# EasyEDA Pro project ProProject_FOC_Driver V2.0_2024-05-31.epro, board PCB1
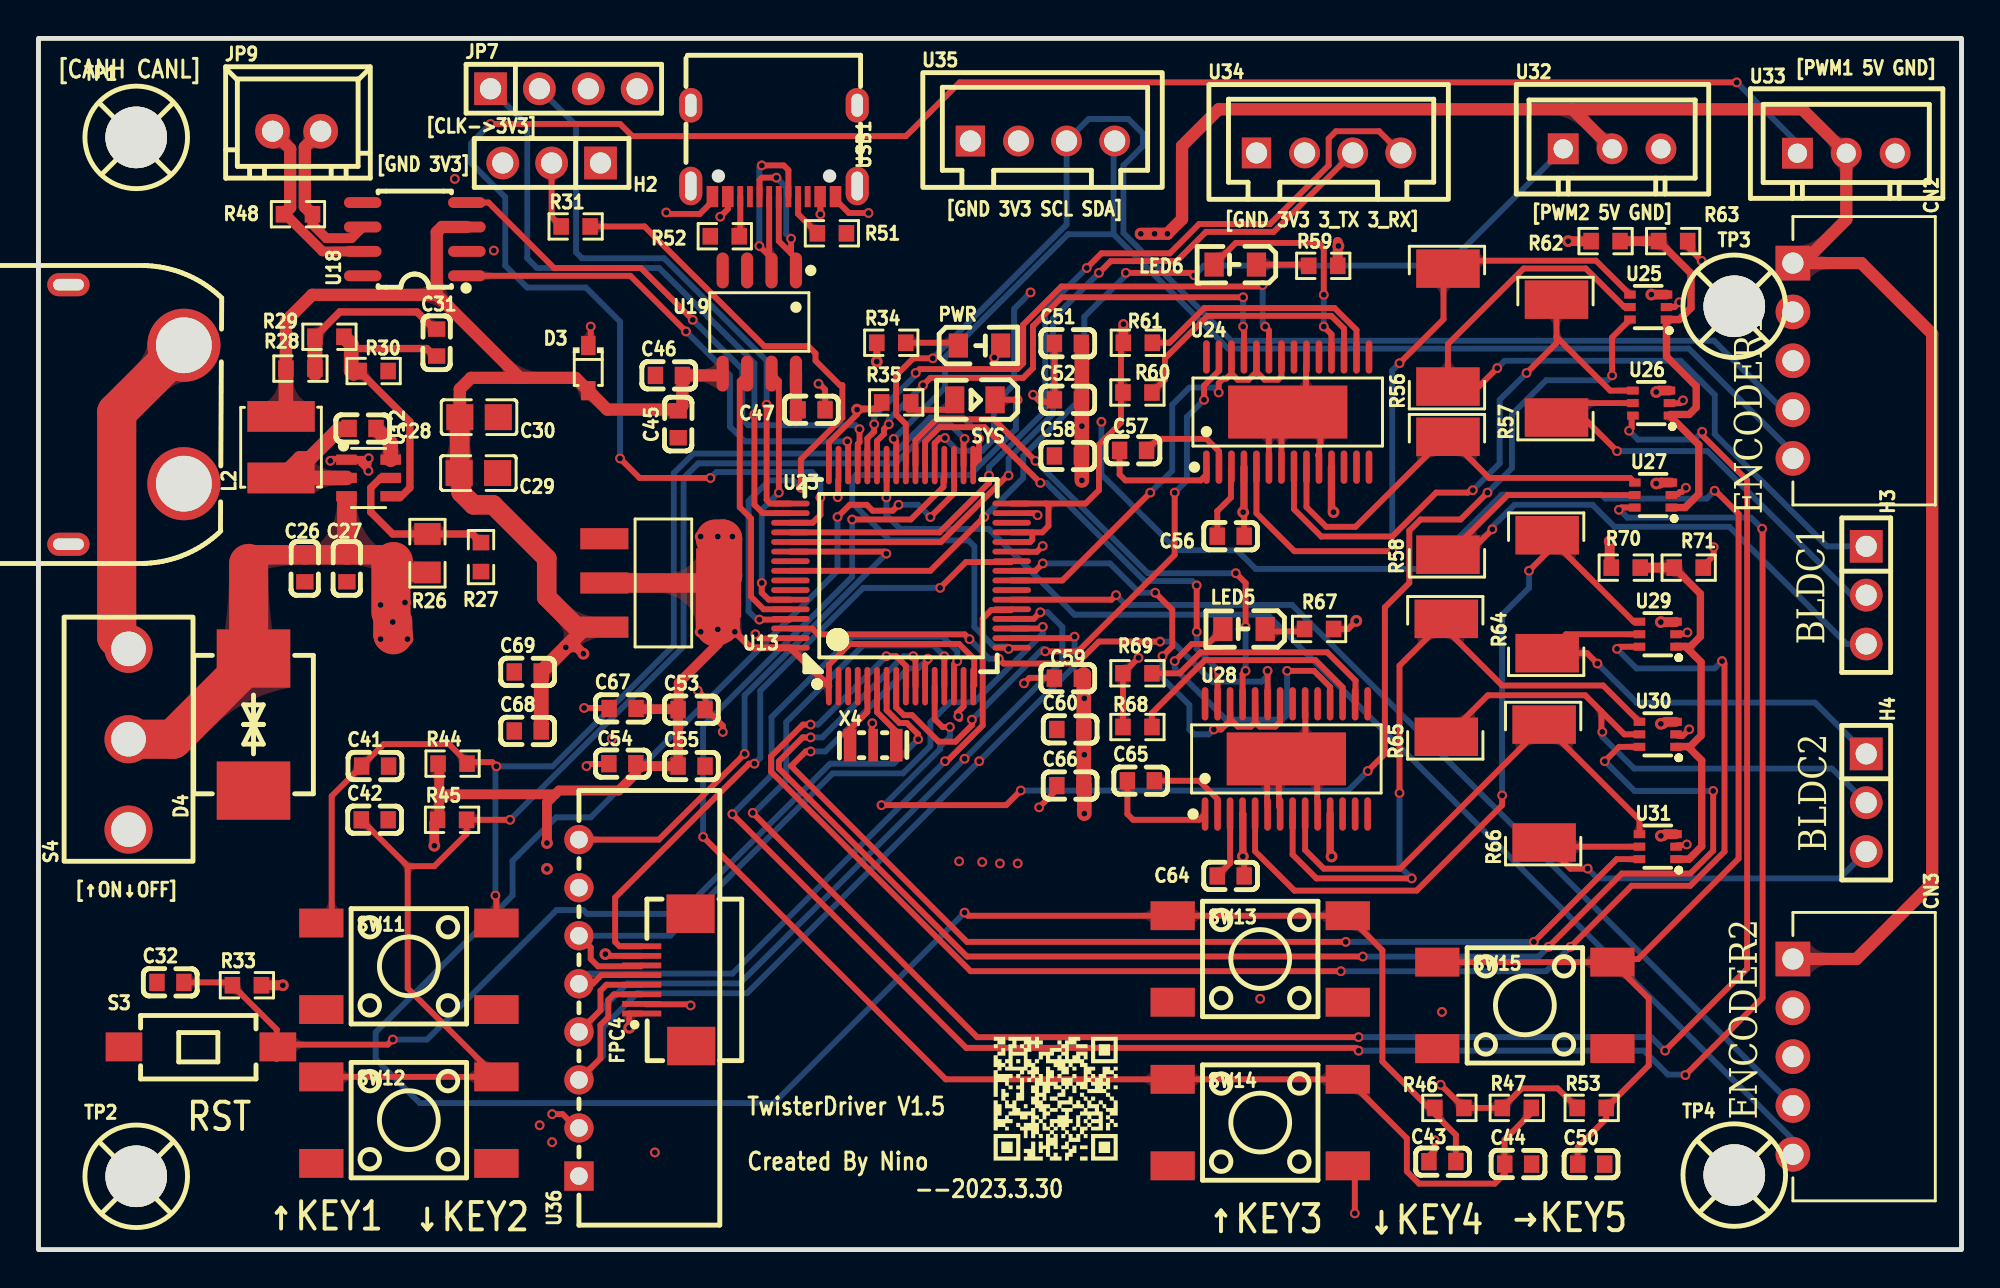
[diagram p2: board, top side]
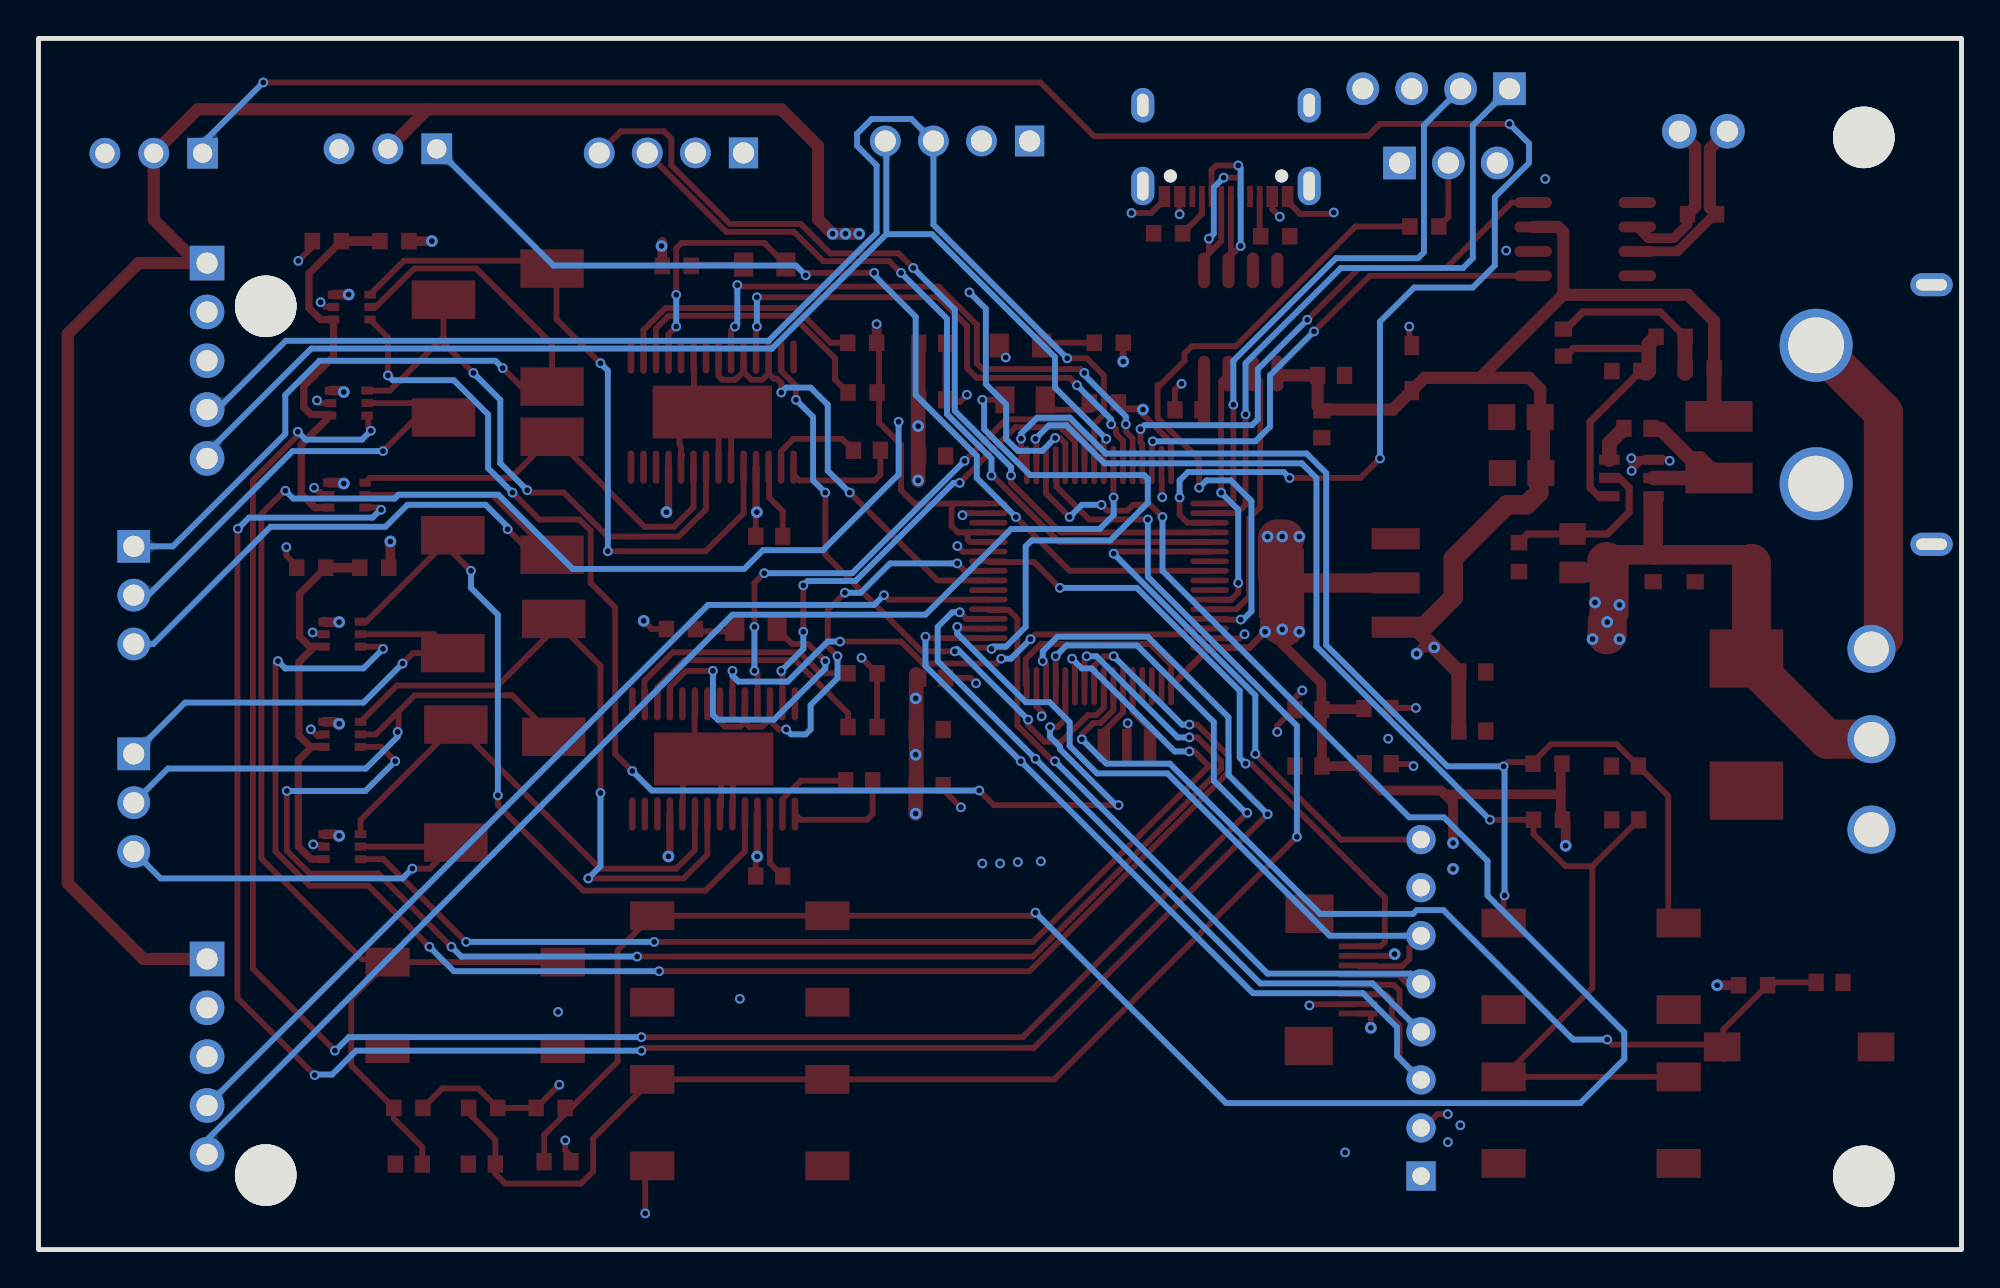
[diagram p3: board, bottom side, seen from below]

Outline 99.95 x 62.99 mm; copper layers: Top Layer, Inner1, Inner2, Bottom Layer. Coordinates in mm from the lower left corner of the outline.
Outline path: rectangle 0,62.99 99.95,0
Stack: Top Layer 0.035mm 外层铜厚1oz / Dielectric1 0.2104mm 7628 RC49% 8.6mil / Inner1 0.0152mm 内层铜厚 / Dielectric2 1.065mm 1.1mm H/HOZ 含铜 / Inner2 0.0152mm 内层铜厚 / Dielectric3 0.2104mm 7628 RC49% 8.6mil / Bottom Layer 0.035mm 外层铜厚1oz

## Design rules (mm)
template: JLCPCB Capability(Two Layers Board)
spacing copperThickness1oz (default): track to track 0.102, other pairs 0.152 to 0.3
spacing copperThickness2oz: track to track 0.203, other pairs 0.152 to 0.3
track width copperThickness1oz (default): min 0.127, default 0.254, max 2.54
track width copperThickness2oz: min 0.203, default 0.254, max 2.54
differential pair differentialPair (default): width min 0.127, default 0.254, max 2.54; gap min 0.152, default 0.152
via viaSize (default): diameter min 0.5, default 0.61, max 10; hole min 0.3, default 0.305, max 6.3

## Placement (name value [footprint] x y rotation side)
C26  100nF  [C0603]  13.84 35.43 90 top
C27  100nF  [C0603]  16.03 35.43 90 top
C28  100nF  [C0603]  16.84 42.71 180 top
C29  22uF  [C0805]  22.86 40.39 180 top
C30  22uF  [C0805]  22.9 43.3 180 top
C31  75pF  [C0603]  20.7 47.17 90 top
C32  100nF  [C0603]  6.86 13.9 0 top
C41  100nF  [C0603]  17.5 25.15 0 top
C42  100nF  [C0603]  17.48 22.35 0 top
C43  100nF  [C0603]  72.97 4.57 180 top
C44  100nF  [C0603]  76.91 4.45 0 top
C45  100nF  [C0603]  33.25 42.93 270 top
C46  100nF  [C0603]  32.77 45.47 0 top
C47  100nF  [C0603]  40.18 43.68 0 top
C50  100nF  [C0603]  80.7 4.44 0 top
C51  100nF  [C0603]  53.5 47.14 0 top
C52  100nF  [C0603]  53.5 44.2 0 top
C53  100nF  [C0603]  33.94 28.08 0 top
C54  100nF  [C0603]  30.34 25.27 180 top
C55  100nF  [C0603]  33.94 25.15 0 top
C56  100nF  [C0603]  61.97 37.1 0 top
C57  10nF  [C0603]  56.89 41.57 0 top
C58  100nF  [C0603]  53.5 41.28 0 top
C59  100nF  [C0603]  53.5 29.72 0 top
C60  100nF  [C0603]  53.63 27.05 0 top
C64  100nF  [C0603]  61.97 19.43 0 top
C65  10nF  [C0603]  57.29 24.38 0 top
C66  100nF  [C0603]  53.63 24.13 0 top
C67  100nF  [C0603]  30.36 28.14 0 top
C68  100nF  [C0603]  25.43 26.97 0 top
C69  10uF  [C0603]  25.43 30.04 0 top
CN1  XT60PW-M  [CONN-TH_XT60PW-M]  4.56 43.43 0 top
CN2  XH-5AW  [CONN-TH_5P-P2.54_XH-5AW_C2908614]  91.19 46.23 270 top
CN3  XH-5AW  [CONN-TH_5P-P2.54_XH-5AW_C2908614]  91.19 10.03 270 top
D3  B5819WS  [SOD-323_L1.8-W1.3-LS2.5-RD]  28.57 45.85 270 top
D4  SMDJ24CA  [SMC_L6.9-W5.9-LS7.9-BI]  11.18 27.31 90 top
FPC4  FPC-05F-8PH20  [fpc-smd_8p-p0.50_fpc-05f-8ph20]  32.64 14.03 90 top
H2  PZ254V-11-03P  [HDR-TH_3P-P2.54-V-M]  26.67 56.52 180 top
H3  PZ254V-11-03P  [HDR-TH_3P-P2.54-V-M]  95 34.04 270 top
H4  PZ254V-11-03P  [HDR-TH_3P-P2.54-V-M]  95 23.24 270 top
JP7  PZ254V-11-04P  [HDR-TH_4P-P2.54-V-M]  27.31 60.38 0 top
JP9  XH-2A  [CONN-TH_2P-P2.50_HCTL_XH-2A-X]  13.42 58.17 0 top
L2  15uH  [IND-SMD_L4.0-W4.0]  12.61 41.73 90 top
LED5  XL-2012SURC  [LED0805-RD_RED]  62.66 32.28 180 top
LED6  XL-2012SURC  [LED0805-RD_RED]  62.2 51.23 180 top
PWR  XL-2012SURC  [LED0805-RD_RED]  48.91 47.02 0 top
R26  511kΩ  [R0805]  20.22 36.22 270 top
R27  105kΩ  [R0603]  23 36.02 90 top
R28  49.9Ω  [R0603]  13.61 45.82 180 top
R29  100kΩ  [R0603]  15.12 47.48 180 top
R30  13.3kΩ  [R0603]  17.42 45.69 180 top
R31  10kΩ  [R0603]  27.92 53.21 0 top
R33  10kΩ  [R0603]  10.83 13.75 0 top
R34  1kΩ  [R0603]  44.32 47.17 0 top
R35  1kΩ  [R0603]  44.58 44.06 0 top
R44  10kΩ  [R0603]  21.52 25.27 0 top
R45  10kΩ  [R0603]  21.5 22.35 0 top
R46  10kΩ  [R0603]  73.33 7.37 180 top
R47  10kΩ  [R0603]  76.84 7.37 0 top
R48  120Ω  [R0603]  13.49 53.85 180 top
R51  5.1kΩ  [R0603]  41.24 52.86 0 top
R52  5.1kΩ  [R0603]  35.67 52.71 180 top
R53  10kΩ  [R0603]  80.73 7.37 0 top
R56  10mΩ  [RES-SMD_L6.4-W3.2-R2512]  73.26 47.95 90 top
R57  10mΩ  [RES-SMD_L6.4-W3.2-R2512]  78.9 46.34 90 top
R58  10mΩ  [RES-SMD_L6.4-W3.2-R2512]  73.26 39.21 90 top
R59  10kΩ  [R0603]  66.78 51.17 0 top
R60  10kΩ  [R0603]  57.12 44.58 180 top
R61  10kΩ  [R0603]  57.14 47.17 180 top
R62  10kΩ  [R0603]  81.45 52.45 180 top
R63  10kΩ  [R0603]  84.96 52.45 180 top
R64  10mΩ  [RES-SMD_L6.4-W3.2-R2512]  78.41 34.09 90 top
R65  10mΩ  [RES-SMD_L6.4-W3.2-R2512]  73.17 29.74 90 top
R66  10mΩ  [RES-SMD_L6.4-W3.2-R2512]  78.26 24.24 90 top
R67  10kΩ  [R0603]  66.56 32.28 0 top
R68  10kΩ  [R0603]  57.12 27.18 180 top
R69  10kΩ  [R0603]  57.12 29.97 180 top
R70  10kΩ  [R0603]  82.5 35.47 180 top
R71  10kΩ  [R0603]  85.77 35.47 180 top
S3  TS-1101-C-W  [SW-SMD_L6.0-W3.3-LS8.0]  8.44 10.54 0 top
S4  SS-12D10L5  [SW-TH_SS-12D10L5]  4.68 26.54 90 top
SW11  -  [SW-SMD_4P-L6.0-W6.0-P4.50-LS9.0-2]  19.25 14.73 0 top
SW12  -  [SW-SMD_4P-L6.0-W6.0-P4.50-LS9.0-2]  19.25 6.73 0 top
SW13  -  [SW-SMD_4P-L6.0-W6.0-P4.50-LS9.0-2]  63.5 15.11 0 top
SW14  -  [SW-SMD_4P-L6.0-W6.0-P4.50-LS9.0-2]  63.5 6.6 0 top
SW15  -  [SW-SMD_4P-L6.0-W6.0-P4.50-LS9.0-2]  77.25 12.7 0 top
SYS  NCD0805G1  [LED0805-R-RD]  48.67 44.2 180 top
TP1  -  [M3螺丝]  5.14 57.78 0 top
TP2  -  [M3螺丝]  5.14 3.75 0 top
TP3  -  [M3螺丝]  88.2 49 0 top
TP4  -  [M3螺丝]  88.2 3.81 0 top
U12  TPS54202DDCR  [SOT-23-6_L2.9-W1.6-P0.95-LS2.8-BL]  17.16 40.13 270 top
U13  LM1117S-3.3  [SOT-223-3_L6.5-W3.4-P2.30-LS7.0-BR]  32.38 34.67 180 top
U18  TJA1050T/CM,118  [SOIC-8_L5.0-W4.0-P1.27-LS6.0-BL]  19.56 52.55 90 top
U19  CH340N  [SOP-8_L4.9-W3.9-P1.27-LS6.0-BL]  37.47 48.24 180 top
U23  STM32G431RBT6  [LQFP-64_L10.0-W10.0-P0.50-LS12.0-BL]  44.83 35.05 0 top
U24  DRV8313PWPR  [HTSSOP-28_L9.8-W4.5-P0.65-LS6.6-BL-EP]  64.93 43.56 0 top
U25  INA199A1DCKR  [SC-70-6_L2.2-W1.3-P0.65-LS2.1-BR]  83.67 49.02 0 top
U26  INA199A1DCKR  [SC-70-6_L2.2-W1.3-P0.65-LS2.1-BR]  83.82 44.03 0 top
U27  INA199A1DCKR  [SC-70-6_L2.2-W1.3-P0.65-LS2.1-BR]  83.92 39.24 0 top
U28  DRV8313PWPR  [HTSSOP-28_L9.8-W4.5-P0.65-LS6.6-BL-EP]  64.86 25.52 0 top
U29  INA199A1DCKR  [SC-70-6_L2.2-W1.3-P0.65-LS2.1-BR]  84.16 32 0 top
U30  INA199A1DCKR  [SC-70-6_L2.2-W1.3-P0.65-LS2.1-BR]  84.16 26.8 0 top
U31  INA199A1DCKR  [SC-70-6_L2.2-W1.3-P0.65-LS2.1-BR]  84.16 20.96 0 top
U32  ZX-XH2.54-3PZZ  [CONN-TH_3P-P2.54_2501S-3P]  81.79 57.25 0 top
U33  ZX-XH2.54-3PZZ  [CONN-TH_3P-P2.54_2501S-3P]  93.96 57.02 0 top
U34  ZX-XH2.54-4PZZ  [CONN-TH_4P-P2.50_4PIN]  67.06 57.04 0 top
U35  ZX-XH2.54-4PZZ  [CONN-TH_4P-P2.50_4PIN]  52.19 57.66 0 top
U36  ZX-XH2.54-8PWZ  [CONN-TH_8P-P2.50_ZX-XH2.54-8PWZ]  28.09 12.57 90 top
USB1  TYPE-C 16PIN 2MD(073)  [USB-C-SMD_TYPE-C-6PIN-2MD-073]  38.23 57.14 180 top
X4  8MHz  [OSC-SMD_3P-L3.2-W1.3-P1.2-L]  43.38 26.23 0 top

## Footprints (pads in the part's own frame, mm; a bottom-side part is the same pattern mirrored in y, then rotated)
C0603
  rect 0.8x0.9 smd: 1(-0.7,0) 2(0.7,0)
C0805
  rect 1.41x1.35 smd: 1(-1,0) 2(1,0)
CONN-TH_2P-P2.50_HCTL_XH-2A-X
  round 1.8 hole 1.1: 1(-1.251,0) 2(1.251,0)
CONN-TH_3P-P2.54_2501S-3P
  rect 1.6x1.6 hole 1: 1(-2.54,0)
  round 1.6 hole 1: 2(0,0) 3(2.54,0)
CONN-TH_4P-P2.50_4PIN
  rect 1.524x1.6 hole 1.1: 1(-3.75,0)
  round 1.6 hole 1.1: 2(-1.25,0) 3(1.25,0) 4(3.75,0)
CONN-TH_5P-P2.54_XH-5AW_C2908614
  rect 1.8x1.8 hole 1.1: 1(-5.08,0)
  round 1.8 hole 1.1: 2(-2.54,0) 3(0,0) 4(2.54,0) 5(5.08,0)
CONN-TH_8P-P2.50_ZX-XH2.54-8PWZ
  rect 1.524x1.524 hole 0.914: 1(-8.75,0)
  round 1.524 hole 0.914: 2(-6.25,0) 3(-3.75,0) 4(-1.25,0) 5(1.25,0) 6(3.75,0) 7(6.25,0) 8(8.75,0)
CONN-TH_XT60PW-M
  round 3.8 hole 2.9: 1(3,-3.6) 2(3,3.6)
  oval 2.2x1.2 hole 1.6x0.6: 3(-3,6.75) 4(-3,-6.75)
fpc-smd_8p-p0.50_fpc-05f-8ph20
  rect 0.3x2.032 smd: 1(-1.75,1.288) 2(-1.25,1.288) 3(-0.75,1.288) 4(-0.25,1.288) 5(0.25,1.288) 6(0.75,1.288) 7(1.25,1.288) 8(1.75,1.288)
  rect 2x2.5 smd: 9(3.44,-1.252) 10(-3.44,-1.288)
HDR-TH_3P-P2.54-V-M
  rect 1.7x1.7 hole 1.1: 1(-2.54,0)
  round 1.7 hole 1.1: 2(0,0) 3(2.54,0)
HDR-TH_4P-P2.54-V-M
  rect 1.7x1.7 hole 1.1: 1(-3.81,0)
  round 1.7 hole 1.1: 2(-1.27,0) 3(1.27,0) 4(3.81,0)
HTSSOP-28_L9.8-W4.5-P0.65-LS6.6-BL-EP
  oval 0.343x1.732 smd: 1(-4.225,-2.866) 2(-3.575,-2.866) 3(-2.925,-2.866) 4(-2.275,-2.866) 5(-1.625,-2.866) 6(-0.975,-2.866) 7(-0.325,-2.866) 8(0.325,-2.866) 9(0.975,-2.866) 10(1.625,-2.866) 11(2.275,-2.866) 12(2.925,-2.866) 13(3.575,-2.866) 14(4.225,-2.866) 15(4.225,2.866) 16(3.575,2.866) 17(2.925,2.866) 18(2.275,2.866) 19(1.625,2.866) 20(0.975,2.866) 21(0.325,2.866) 22(-0.325,2.866) 23(-0.975,2.866) 24(-1.625,2.866) 25(-2.275,2.866) 26(-2.925,2.866) 27(-3.575,2.866) 28(-4.225,2.866)
  rect 6.2x2.75 smd: 29(0,0)
IND-SMD_L4.0-W4.0
  rect 1.6x3.5 smd: 1(-1.6,0) 2(1.6,0)
LED0805-R-RD
  rect 1x1.399 smd: 1(1.05,0) 2(-1.05,0)
LED0805-RD_RED
  rect 1x1.25 smd: 1(-1.1,0) 2(1.1,0)
LQFP-64_L10.0-W10.0-P0.50-LS12.0-BL
  oval 0.3x2 smd: 1(-3.75,-5.75) 2(-3.25,-5.75) 3(-2.75,-5.75) 4(-2.25,-5.75) 5(-1.75,-5.75) 6(-1.25,-5.75) 7(-0.75,-5.75) 8(-0.25,-5.75) 9(0.25,-5.75) 10(0.75,-5.75) 11(1.25,-5.75) 12(1.75,-5.75) 13(2.25,-5.75) 14(2.75,-5.75) 15(3.25,-5.75) 16(3.75,-5.75) 33(3.75,5.75) 34(3.25,5.75) 35(2.75,5.75) 36(2.25,5.75) 37(1.75,5.75) 38(1.25,5.75) 39(0.75,5.75) 40(0.25,5.75) 41(-0.25,5.75) 42(-0.75,5.75) 43(-1.25,5.75) 44(-1.75,5.75) 45(-2.25,5.75) 46(-2.75,5.75) 47(-3.25,5.75) 48(-3.75,5.75)
  oval 2x0.3 smd: 17(5.75,-3.75) 18(5.75,-3.25) 19(5.75,-2.75) 20(5.75,-2.25) 21(5.75,-1.75) 22(5.75,-1.25) 23(5.75,-0.75) 24(5.75,-0.25) 25(5.75,0.25) 26(5.75,0.75) 27(5.75,1.25) 28(5.75,1.75) 29(5.75,2.25) 30(5.75,2.75) 31(5.75,3.25) 32(5.75,3.75) 49(-5.75,3.75) 50(-5.75,3.25) 51(-5.75,2.75) 52(-5.75,2.25) 53(-5.75,1.75) 54(-5.75,1.25) 55(-5.75,0.75) 56(-5.75,0.25) 57(-5.75,-0.25) 58(-5.75,-0.75) 59(-5.75,-1.25) 60(-5.75,-1.75) 61(-5.75,-2.25) 62(-5.75,-2.75) 63(-5.75,-3.25) 64(-5.75,-3.75)
M3螺丝
  round 3.2 hole 3.2: 1(-0.064,0.064)
OSC-SMD_3P-L3.2-W1.3-P1.2-L
  rect 0.65x1.7 smd: 1(-1.2,0) 3(1.2,0)
  rect 0.5x1.7 smd: 2(0,0)
R0603
  rect 0.806x0.864 smd: 1(-0.753,0) 2(0.753,0)
R0805
  rect 1.133x1.377 smd: 1(-1,0) 2(1,0)
RES-SMD_L6.4-W3.2-R2512
  rect 2x3.3 smd: 1(-3.067,0) 2(3.067,0)
SC-70-6_L2.2-W1.3-P0.65-LS2.1-BR
  rect 0.6x0.42 smd: 1(0.95,-0.65) 2(0.95,0) 3(0.95,0.65) 4(-0.95,0.65) 5(-0.95,0) 6(-0.95,-0.65)
SMC_L6.9-W5.9-LS7.9-BI
  rect 3.03x3.82 smd: 1(-3.435,0) 2(3.435,0)
SOD-323_L1.8-W1.3-LS2.5-RD
  rect 1x0.75 smd: 1(-1.173,0) 2(1.173,0)
SOIC-8_L5.0-W4.0-P1.27-LS6.0-BL
  oval 0.569x1.95 smd: 1(-1.905,-2.705) 2(-0.635,-2.705) 3(0.635,-2.705) 4(1.905,-2.705) 5(1.905,2.705) 6(0.635,2.705) 7(-0.635,2.705) 8(-1.905,2.705)
SOP-8_L4.9-W3.9-P1.27-LS6.0-BL
  oval 0.63x1.865 smd: 1(-1.905,-2.683) 2(-0.635,-2.683) 3(0.635,-2.683) 4(1.905,-2.683) 5(1.905,2.683) 6(0.635,2.683) 7(-0.635,2.683) 8(-1.905,2.683)
SOT-23-6_L2.9-W1.6-P0.95-LS2.8-BL
  rect 0.532x1.072 smd: 1(-0.95,-1.149) 2(0,-1.149) 3(0.95,-1.149) 4(0.95,1.149) 5(0,1.149) 6(-0.95,1.149)
SOT-223-3_L6.5-W3.4-P2.30-LS7.0-BR
  rect 2.5x1.1 smd: 1(2.97,-2.3) 2(2.97,0) 3(2.97,2.3)
  rect 2.34x3.6 smd: 4(-2.97,0)
SW-SMD_4P-L6.0-W6.0-P4.50-LS9.0-2
  rect 2.3x1.5 smd: 1(-4.55,2.25) 2(4.55,2.25) 3(-4.55,-2.25) 4(4.55,-2.25)
SW-SMD_L6.0-W3.3-LS8.0
  rect 1.9x1.5 smd: 1(-4,0) 2(4,0)
SW-TH_SS-12D10L5
  round 2.5 hole 1.8: 1(-4.7,0) 2(0,0) 3(4.7,0)
USB-C-SMD_TYPE-C-6PIN-2MD-073
  rect 0.6x1.1 smd: 1(-3.2,2.375) 2(-2.4,2.375) 11(2.4,2.375) 12(3.2,2.375)
  rect 0.3x1.1 smd: 3(-1.75,2.375) 4(-1.25,2.375) 5(-0.75,2.375) 6(-0.25,2.375) 7(0.25,2.375) 8(0.75,2.375) 9(1.25,2.375) 10(1.75,2.375)
  oval 1.2x2 hole 0.6x1.5: 13(-4.325,1.825) 14(4.325,1.825)
  oval 1.2x1.8 hole 0.6x1.2: 13(-4.325,-2.375) 14(4.325,-2.375)

## Nets
As in the schematic.

Pads without a net: CN2 3; CN3 3; FPC4 9 10; S4 1; TP1 1; TP2 1; TP3 1; TP4 1; U18 5; U19 4; U23 2 3 4 30 55; U24 12 13 15 19 21; U28 12 13 15 19 21; USB1 3 9

## Via types
v1: diameter 0.508, hole 0.305, Top Layer to Bottom Layer, 191 vias
v2: diameter 0.61, hole 0.305, Top Layer to Bottom Layer, 43 vias

## Routing (per net, layer and track width the routed paths; a pad name or vN(x,y) marks a point on that pad's centre or on a via; arc(x,y) is an arc through that point)
+1.65V: length 20.9
  Top Layer w0.381: U27.1 85.59,38.59 86.29,39.3 86.29,41.86 U26.1 84.83,43.43 85.79,43.43 86.16,43.8 86.16,44.91 84.62,46.45 U25.1 85.28,48.37 85.89,48.98 85.89,50.77 R63.2
  Top Layer w0.508: 82.2,52.45 R63.2
+1.65V_2: length 21
  Top Layer w0.381: 85.6,31.37 85.13,31.37 U29.1 ; 85.6,31.37 85.86,31.37 86.38,31.89 86.38,34.11 R71.2 ; 85.6,31.37 86.41,30.55 86.41,26.74 85.84,26.16 85.72,26.16 ; 85.72,26.16 86.45,25.44 86.45,20.97 85.78,20.31 U31.1 ; 85.72,26.16 85.13,26.16 U30.1
  Top Layer w0.508: R70.1 R71.2
+3V3: length 355.7
  Top Layer w0.305: 52.35,38.8 52.49,38.66 52.49,37.63 52.17,37.3 51.65,37.3 ; 52.35,38.8 54.42,38.8 55.12,39.5 55.12,41.86 56.26,43.01 56.26,47.04 R61.2 ; 52.35,38.8 U23.32 ; FPC4.1 30.7,12.28 v2(30.7,11.53) ; U23.48 41.08,41.98 42.54,43.44 v2(42.54,43.69) ; v2(29.46,15.37) 29.56,15.28 FPC4.7 ; v1(72.88,8.57) R46.1 R47.1 77.1,8.38 78.96,8.38 R53.1 ; U23.28 51.53,36.8 51.65,36.92 51.65,37.3 ; v2(68.49,32.7) 68.07,32.28 R67.2 ; 56.37,27.18 56.37,29.97 v1(57.17,30.78) ; 51.65,37.3 U23.29 ; U23.16 48.64,29.36 48.64,30.71 47.85,31.5 42.16,31.5 41.08,30.41 U23.1
  Top Layer w0.355: v2(42.54,43.69) 42.58,43.72 43.7,43.72 ; v2(36.19,32.13) 37.02,31.3 U23.64 U23.1 ; R34.1 v2(43.57,46.19)
  Top Layer w0.508: 33.27,28.11 C53.1 C55.1 31.2,25.15 31.06,25.29 ; 33.27,28.11 31.09,28.11 C67.2 ; 33.27,28.11 33.27,29.46 35.31,31.5 v2(35.31,32.26) ; v2(84.08,44.6) 84.14,44.6 84.22,44.68 84.77,44.68 ; v2(20.57,21) 20.57,22.18 R45.1 20.83,22.44 20.83,23.88 ; U29.3 85.09,32.63 v2(84.32,32.63) ; v2(12.7,13.75) R33.2 ; 20.83,23.88 21.03,23.68 26.85,23.68 ; 20.83,23.88 20.83,25.21 R44.1 ; v2(36.07,37.08) 36.07,35.39 U13.4 36.19,33.83 v2(36.19,32.13) ; 31.06,25.29 31.06,24.77 30.16,23.88 27.05,23.88 26.85,23.68 ; 31.06,25.29 C54.1 ; U27.3 84.32,39.89 84.26,39.84 v2(84.08,39.84) ; v1(56.39,48.13) 56.39,47.17 R61.2 ; 67.53,52.16 67.53,52.42 ; 67.53,52.16 v2(67.56,52.2) ; 67.53,52.16 R59.2 ; v2(83.83,49.67) U25.3 ; U30.3 84.56,27.45 84.46,27.35 v2(84.32,27.35) ; v2(84.32,21.52) 84.47,21.52 84.56,21.61 U31.3 ; 26.85,23.68 26.43,23.25 v2(26.43,21.14) ; R62.2 v2(79.5,52.45) ; v2(81.66,36.83) 81.66,35.51 81.62,35.47
  Top Layer w1.016: U13.2 U13.4
  Top Layer w2.032: 35.31,34.67 35.31,32.64 35.43,32.51 ; 35.18,36.96 35.56,36.96 35.56,35.05 35.18,34.67 35.18,32.39
  Inner1 w0.305: v2(84.32,21.52) 84.32,18.54 82.93,17.15 71.75,17.15 70.87,16.26 70.87,9.53 71.5,8.89 72.56,8.89 v1(72.88,8.57) R46.1 ; 56.37,29.97 v1(57.17,30.78) 57.17,31.39 58.79,33 68.19,33 v2(68.49,32.7) 69.72,33.93 69.72,37.85 72.39,40.51 83.82,40.51 83.95,40.39 83.95,39.97 v2(84.08,39.84)
  Inner1 w0.355: H2.1 31.12,58.42 JP7.4 ; U36.7 29.46,17.45 v2(29.46,15.37) 29.61,15.22
  Inner1 w0.381: 30.59,12.19 29.34,12.19 28.96,12.57 27.05,12.57 26.43,13.2 v2(26.43,19.8)
  Inner1 w0.508: 60.12,53.73 64.65,53.73 65.53,54.61 ; 60.12,53.73 50.94,53.73 ; 60.12,53.73 60.12,51.87 v1(56.39,48.13) ; 20.57,22.23 v2(20.57,21) 20.57,19.81 14.51,13.75 v2(12.7,13.75) R33.2 ; v2(36.07,37.08) 36.07,40.51 39.24,43.69 v2(42.54,43.69) 42.54,45.16 v2(43.57,46.19) 43.57,48.14 44.2,48.77 45.97,48.77 49.28,52.07 ; 31.12,58.42 31.62,57.91 43.31,57.91 49.15,52.07 49.28,52.07 ; 50.94,53.73 49.28,52.07 ; 50.94,53.73 U35.2 ; 30.7,12.16 v2(30.7,11.53) 30.7,6.43 U36.1 ; U34.2 65.53,56.76 65.53,54.61 ; U36.7 27.41,18.82 v2(26.43,19.8) v2(26.43,21.14) ; v2(84.32,21.52) v2(84.32,27.35) v2(84.32,32.63) 84.32,33.41 83.82,33.91 82.55,33.91 81.66,34.8 v2(81.66,36.83) 82.3,36.83 84.08,38.61 v2(84.08,39.84) v2(84.08,44.6) 83.83,44.85 v2(83.83,49.67) 83.21,50.29 81.66,50.29 v2(79.5,52.45) 79.38,52.58 67.56,52.58 ; 65.53,54.61 67.56,52.58 ; 67.56,52.58 v2(67.56,52.2)
  vias: v2(34.42,37.08) v2(34.42,32.13) v2(35.31,37.08)
GND: length 54.9
  Top Layer w0.305: v1(72.57,5.68) 72.57,5.17 72.11,4.71 ; 85.31,39.4 85.2,39.29 84.95,39.29 ; 85.31,39.4 85.38,39.4 ; 85.31,39.4 85.38,39.4 ; v1(35.57,26.92) 35.57,27.25 34.77,28.05 ; 52.82,44.09 52.8,44.08 ; 52.82,44.09 52.82,47.2 ; 52.82,44.09 52.06,44.09 51.74,44.41 ; 41.56,40.02 41.56,39.09 ; v1(68.42,1.88) 68.42,4.09 68.19,4.32 ; v1(85.79,27.06) 85.46,26.72 85.22,26.72 ; 33.85,12.73 33.83,12.75 31.56,12.75 ; 17.15,41.14 17.13,41.13 15.27,41.13 v1(15.17,41.02) ; 17.15,41.14 v1(17.16,41.16) ; 17.15,41.14 17.15,40.89 ; 85.38,39.4 85.4,39.4 v1(85.62,39.62) ; 48.08,28.47 48.08,28.25 47.74,27.9 47.74,27.73 47.88,27.59 47.88,27.7 47.8,27.78 ; 29.69,25.25 28.59,25.25 v1(28.48,25.15) ; v1(28.36,28.17) 29.32,28.17 29.42,28.07 ; 50.01,47.31 50.01,46.72 v1(49.68,46.4) ; v1(34.26,29.08) 34.67,28.67 34.67,28.02 ; 41.48,54.55 42.12,53.91 v1(43.14,53.91) ; 37.32,31.98 37.52,31.78 38.42,31.78 ; 66.63,42.49 66.63,41.84 66.56,41.77 66.56,41.38 66.5,41.32 ; 52.74,29.73 51.5,29.73 v1(51.22,29.45) ; 84.77,44.02 85.33,44.02 v1(85.47,44.17) ; 85.62,52.54 85.62,52.25 v1(86.44,51.42) ; v1(52.01,23) 52.98,23.97 52.98,24.21 ; 51.09,36.29 51.89,36.29 v1(52.19,36.59) ; 66.46,23.34 66.46,24.3 66.51,24.34 ; 84.66,49.03 85.04,49.03 v1(85.28,49.27) ; v1(26.7,7.04) 27.24,7.04 27.99,6.29 ; v1(87.07,36.53) 87.07,36.09 86.52,35.54 ; 63.82,24.33 63.86,24.3 63.86,23.09 ; 16.95,40.96 17.07,40.96 17.15,40.89 ; v1(32.63,53.94) 32.7,53.86 34.37,53.86 34.98,54.47 ; v1(85.67,21.07) 85.63,21.03 85.17,21.03 ; 40.56,45.05 40.88,44.73 40.88,43.7 ; v1(85.7,32.1) 85.63,32.02 85.08,32.02 ; 43.31,26.42 43.31,27.35 v1(43.34,27.38) ; 64.6,41.29 64.6,42.48 ; 65.88,45.99 65.88,44.46 ; 65.85,27.9 65.85,26.38 ; 16.15,41.06 16.59,41.06 v1(17.15,40.5) 17.15,40.89 ; 51.43,38.3 51.82,38.3 v1(51.93,38.2) ; 64.4,24.25 64.47,24.17 64.47,23.04 ; 63.95,41.26 63.95,42.69
  vias: v1(21.64,55.69) v1(23.66,51.96) v1(26.05,6.46) v1(26.69,5.59) v1(29.8,26.57) v1(32.04,5.05) v1(33.89,12.7) v1(37.26,32.01) v1(40.54,45.03) v1(41.54,39.13) v1(47.81,27.74) v1(47.85,20.19) v1(49.05,20.15) v1(49.97,20.08) v1(50.89,20.08) v1(51.69,44.46) v1(63.5,13.04) v1(72.94,12.36)
VBUS: length 23
  Top Layer w0.305: D3.1 28.7,47.15 v1(28.7,48.01) ; USB1.11 35.83,54.12 v1(35.43,53.72) ; USB1.2 40.64,54.75 v1(40.64,53.85)
  Inner1 w0.305: v1(40.64,53.85) 40.13,53.85 40,53.98 40,56.52 39.5,57.02 36.83,57.02 36.19,56.39 36.19,55.12 35.81,54.74 35.81,54.1 v1(35.43,53.72) 34.04,53.72 28.7,48.39 v1(28.7,48.01)
+5: length 220.6
  Top Layer w0.508: v2(27.41,31.32) 27.99,31.32 v2(28.32,30.99)
  Top Layer w0.635: 20.7,49.66 20.7,52.92 20.97,53.19 U18.3 ; 20.7,49.66 25.02,45.34 ; 20.7,49.66 14.22,49.66 12.86,48.29 R28.2 ; 25.02,45.34 22.48,45.34 21.9,44.76 C30.2 ; 25.02,45.34 27.91,45.34 D3.2 29.56,43.69 33.27,43.69 33.47,43.88 C46.2 35.46,45.47 U19.5 ; 91.69,51.31 94.74,51.31 98.42,47.63 98.42,19.05 94.49,15.11 CN3.1 ; 91.69,51.31 CN2.1 ; 91.69,51.31 93.96,53.57 U33.2 91.67,59.31 79.73,59.31 ; 79.73,59.31 61.34,59.31 59.44,57.4 59.44,53.59 v2(58.67,52.83) v2(58.01,52.83) v2(57.29,52.83) ; 79.73,59.31 81.79,57.25
  Top Layer w0.762: L2.2 12.86,43.59 R28.2 ; C68.2 C69.2 v2(27.41,31.32) 28.46,32.37
  Top Layer w1.016: U13.3 27.97,32.37 26.42,33.93 26.42,35.94 23.62,38.74 22.61,38.74 21.97,39.37 21.97,40.13 ; C29.2 21.9,40.42 C30.2
  Inner1 w0.635: v2(28.32,30.99) 33.91,30.99 40.89,24 49.53,24 53.12,27.6 53.12,50.84 55.12,52.83 v2(57.29,52.83)
BOOT0: length 34.4
  Top Layer w0.305: R31.2 31.5,53.21 37.72,46.99 40,46.99 40.39,46.61 40.39,46.23 41.66,44.96 41.78,44.96 41.78,43.26 39.62,41.1 v1(39.62,39.62) ; U23.61 39.04,32.77 v1(37.47,32.77)
  Bottom Layer w0.305: v1(39.62,39.62) 39.24,40.01 37.97,40.01 36.91,38.94 36.91,33.2 37.34,32.77 v1(37.47,32.77)
CAN_RX: length 28.7
  Top Layer w0.305: v1(34.01,48.36) 31.31,51.05 26.79,51.05 23.39,54.46 U18.4 ; v1(42.67,42.67) 42.67,41.99 42.58,41.9 U23.45
  Bottom Layer w0.305: v1(34.01,48.36) 36.58,45.79 36.58,43.18 36.88,42.88 42.47,42.88 v1(42.67,42.67)
CAN_TX: length 26.2
  Top Layer w0.305: U18.1 30.76,50.65 v1(33.66,47.75) ; v1(42.04,42.04) 42.08,41.99 U23.46
  Bottom Layer w0.305: v1(42.04,42.04) 36.7,42.04 35.94,42.8 35.94,45.47 v1(33.66,47.75)
CANH: length 9.8
  Top Layer w0.508: R48.2 12.83,53.85 14.76,51.92 U18.7
  Top Layer w0.635: R48.2 13.08,54.2 13.08,57.25 JP9.1
CANL: length 8.5
  Top Layer w0.508: R48.1 14.24,53.32 14.96,52.61 16.27,52.61 U18.6
  Top Layer w0.635: JP9.2 13.84,57.34 13.84,54.25 R48.1
CS1: length 66.5
  Top Layer w0.305: v1(51.05,23.88) 50.29,23.11 v1(43.81,23.11) ; v1(69.09,24.89) 69.98,25.78 69.98,33.4 71.25,34.67 71.25,37.39 71.83,37.97 73.91,37.97 v1(75.31,39.37) ; U23.12 46.58,27.59 46.99,27.18 v1(47.37,27.18) ; v1(81.79,45.47) 81.79,47.44 U25.6
  Bottom Layer w0.305: v1(75.31,39.37) 76.58,40.64 76.58,43.43 78.36,45.21 81.53,45.21 v1(81.79,45.47) ; v1(69.09,24.89) 68.07,23.88 v1(51.05,23.88) ; v1(43.81,23.11) 43.94,23.11 46.86,26.04 46.86,26.16 47.37,26.67 v1(47.37,27.18)
CS2: length 109.4
  Top Layer w0.305: v1(37.12,22.71) 48.79,11.04 68.61,11.04 ; 86.45,42.36 88.81,40.01 88.81,14.61 v1(84.54,10.35) ; U23.13 v1(47.08,30.86) ; v1(82.67,42.59) 82.81,42.72 82.81,43.41
  Bottom Layer w0.305: v1(82.67,42.59) 83.13,42.13 86.07,42.13 v1(86.47,42.53) ; v1(47.08,30.86) 46.52,31.42 42.85,31.42 38.86,27.43 38.86,24.38 37.15,22.68 37.15,22.68 ; v1(68.61,11.05) 83.82,11.05 84.52,10.35
CS2_1: length 84.9
  Top Layer w0.305: v1(87.5,30.61) 87.63,30.48 87.63,20.7 85.85,18.92 82.8,18.92 v1(79.63,15.75) ; v1(82.04,31.24) 82.15,31.35 83.21,31.35 ; v1(67.69,14.48) 48.45,14.48 38.07,24.85 38.07,25.65 39.73,27.31 v1(40.13,27.31) ; 45.09,29.31 U23.9 45.08,30.36 44.58,30.86 v1(44.07,30.86)
  Bottom Layer w0.305: v1(87.5,30.61) 87.12,30.23 83.06,30.23 v1(82.04,31.24) ; v1(79.63,15.75) 78.36,14.48 v1(67.69,14.48) ; v1(40.13,27.31) 40.51,27.31 v1(44.07,30.86)
CS2_2: length 77.6
  Top Layer w0.305: 83.21,26.15 82.15,26.15 v1(81.41,25.4) ; U23.10 45.58,30.75 v1(45.47,30.86) ; v1(78.49,15.75) 82.3,19.56 85.85,19.56 87.04,20.75 v1(87.04,23.85) ; v1(40.13,26.64) 39.72,26.64 38.48,25.4 38.48,25.02 48.26,15.24 v1(68.83,15.24)
  Bottom Layer w0.305: v1(45.47,30.86) 44.96,30.86 40.73,26.64 v1(40.13,26.64) ; v1(68.83,15.24) 77.98,15.24 v1(78.49,15.75) ; v1(81.41,25.4) 82.96,23.85 v1(87.04,23.85)
CS2_3: length 60.6
  Top Layer w0.305: v1(46.23,30.73) 46.23,30.61 46.08,30.46 U23.11 ; 83.21,20.31 82.03,20.31 v1(77.72,16) ; v1(67.94,16) 48.26,16 39.12,25.15 39.88,25.91 v1(40.13,25.91)
  Bottom Layer w0.305: v1(46.23,30.73) 45.72,30.23 45.21,30.23 40.89,25.91 v1(40.13,25.91) ; v1(67.94,16) v1(77.72,16)
CS3: length 113.2
  Top Layer w0.305: U23.14 47.58,30.44 v1(47.75,30.61) ; v1(85.6,9.08) 89.61,13.09 89.61,37.5 ; 68.5,10.49 48.22,10.49 v1(36.06,22.64) ; v1(82.14,38.48) 82.26,38.6 82.88,38.6
  Bottom Layer w0.305: v1(47.75,30.61) 47.75,31.12 46.99,31.88 42.29,31.88 38.1,27.69 38.1,24.68 v1(36.06,22.64) ; 85.6,9.1 84.68,9.1 83.44,10.34 v1(68.61,10.34) ; v1(89.58,37.49) 89.01,38.07 82.59,38.07 82.13,38.52 82.13,38.55
D+: length 10.3
  Top Layer w0.305: 39.12,51.81 39.24,51.69 39.24,51.05 U19.1 ; 39.12,51.81 v1(39.12,52.58) ; 39.12,51.81 38.48,52.45 USB1.6 ; v1(38.35,55.75) 37.59,55.75 37.48,55.64 USB1.8
  Bottom Layer w0.305: v1(39.12,52.58) 38.86,52.83 38.86,55.25 v1(38.35,55.75)
D-: length 11.7
  Top Layer w0.305: U19.2 38.1,51.56 37.98,51.69 ; USB1.5 38.98,56.15 38.73,56.39 v1(37.59,56.39) ; 37.98,51.69 v1(37.47,52.2) ; 37.98,51.69 USB1.7
  Bottom Layer w0.305: v1(37.47,52.2) 37.47,56.26 v1(37.59,56.39)
EN: length 24.2
  Top Layer w0.305: 62,45.57 61.74,45.3 61.57,45.3 61.34,45.07 v1(61.34,44.58) ; 62,45.57 62.33,45.24 62.89,45.24 63.3,45.65 63.3,45.66 ; 62,45.57 U24.26 ; U23.24 53.22,34.8 v1(57.78,39.37) ; 63.3,45.66 63.73,45.24 64.42,45.24 64.6,45.43 U24.22 ; 63.3,45.66 U24.24
  Bottom Layer w0.305: v1(61.34,44.58) 61.09,44.83 59.82,44.83 58.93,43.94 58.93,40.51 v1(57.78,39.37)
EN2: length 24.9
  Top Layer w0.305: 61.93,27.6 61.93,27.52 61.47,27.05 v1(61.09,27.05) ; 61.93,27.6 U28.26 ; 61.93,27.6 62.34,27.2 63.01,27.2 63.25,27.43 ; 63.25,27.43 63.48,27.2 64.28,27.2 64.53,27.45 U28.22 ; 63.25,27.43 63.25,28.37 U28.24 ; v1(58.04,34.16) 58.93,33.27 58.93,31.37 v1(58.42,30.86) ; v1(52.2,35.69) 51.81,35.3 U23.25
  Bottom Layer w0.305: v1(58.04,34.16) 57.21,34.16 55.69,35.69 v1(52.2,35.69) ; v1(61.09,27.05) 60.83,26.8 60.07,26.8 59.82,27.05 59.82,28.32 58.42,29.72 v1(58.42,30.86)
ENCODER2_SCL: length 51.7
  Top Layer w0.305: v1(56.01,34.04) 55.77,33.8 U23.22
  Bottom Layer w0.305: v1(56.01,34.04) 56.51,33.53 65.15,33.53 CN3.4
ENCODER2_SDA: length 63.9
  Top Layer w0.305: U23.42 44.08,39.13 v1(44.07,39.12)
  Bottom Layer w0.305: CN3.5 91.19,5.72 63.88,33.02 53.85,33.02 49.39,37.48 44.79,37.48 44.07,38.2 v1(44.07,39.12)
ENCODER_SCL: length 70.3
  Top Layer w0.305: U23.40 45.08,42.93 44.58,43.43 44.58,45.47 45.47,46.36 v1(46.48,46.36)
  Bottom Layer w0.305: CN2.4 90.67,43.69 87.09,47.27 62,47.27 56.39,52.88 56.39,56.39 57.4,57.4 57.4,58.04 56.64,58.8 54.58,58.8 U35.3 53.44,53.31 v1(46.48,46.36)
ENCODER_SDA: length 63.4
  Top Layer w0.305: v1(44.45,42.16) 44.58,42.03 U23.41
  Bottom Layer w0.305: 55.88,52.81 61.83,46.86 85.77,46.86 91.19,41.45 CN2.5 ; 55.88,52.81 55.88,57.6 U35.4 ; 55.88,52.81 53.51,52.81 47.12,46.42 47.12,44.83 v1(44.45,42.16)
IN1: length 31.7
  Top Layer w0.305: v1(59.06,39.37) 59.06,36.13 54.04,31.12 v1(52.32,31.12) ; U23.8 44.58,28.19 44.98,27.79 45.41,27.79 46.79,26.42 47.66,26.42 48.51,27.27 v1(48.51,27.56) ; v1(60.58,44.2) 60.58,44.93 61.35,45.71 U24.27
  Bottom Layer w0.305: v1(59.06,39.37) 59.69,40.01 59.69,43.31 v1(60.58,44.2) ; v1(48.51,27.56) 52.2,31.24
IN2: length 28.1
  Top Layer w0.305: v1(45.97,44.96) 46.35,45.34 51.18,45.34 51.69,45.85 51.69,48.04 53.18,49.53 v1(62.61,49.53) ; v1(44.2,42.93) 43.94,42.67 43.94,42.42 43.58,42.06 U23.43 ; U24.25 62.65,47.96 v1(62.61,48.01)
  Bottom Layer w0.305: v1(45.97,44.96) 44.2,43.18 v1(44.2,42.93) ; v1(62.61,49.53) v1(62.61,48.01)
IN2_1: length 25.7
  Top Layer w0.305: U28.27 61.28,30.04 v1(61.34,30.1) ; U23.38 46.08,42.02 46.84,42.77 49.17,42.77 v1(52.07,39.88) ; v1(60.2,32.13) v1(60.2,34.54)
  Bottom Layer w0.305: v1(60.2,32.13) 60.2,31.24 v1(61.34,30.1) ; v1(60.2,34.54) 59.97,34.77 57.49,34.77 52.38,39.88 v1(52.07,39.88)
IN2_2: length 28.8
  Top Layer w0.305: v1(62.23,35.18) 62.74,34.67 v1(62.74,32.39) ; U28.25 62.58,29.94 v1(62.74,30.1) ; U23.39 45.58,42.09 46.67,43.18 49.66,43.18 v1(51.82,41.02)
  Bottom Layer w0.305: v1(51.82,41.02) 57.66,35.18 v1(62.23,35.18) ; v1(62.74,32.39) v1(62.74,30.1)
IN2_3: length 29
  Top Layer w0.305: v1(49.91,30.73) 50.16,30.48 53.97,30.48 55.12,31.62 v1(58.29,31.62) ; v1(48.39,31.75) 48.14,32 40.52,32 40.22,32.3 U23.62 ; U28.23 63.88,30.1
  Bottom Layer w0.305: v1(48.39,31.75) 49.4,30.73 v1(49.91,30.73) ; v1(63.88,30.1) 63.88,29.85 63.58,29.54 61.01,29.54 58.93,31.62 v1(58.29,31.62)
IN3: length 30.8
  Top Layer w0.305: U23.44 43.08,42.19 43.43,42.55 v1(43.43,42.93) ; v1(63.63,50.17) 63.55,50.09 53.16,50.09 51.18,48.1 51.18,46.1 50.88,45.8 45.8,45.8 v1(45.59,45.59) ; U24.23 63.95,47.81 v1(63.75,48.01)
  Bottom Layer w0.305: v1(43.43,42.93) 43.43,43.33 45.59,45.49 v1(45.59,45.59) ; v1(63.63,50.17) 63.63,48.13 v1(63.75,48.01)
KEY1: length 65.2
  Top Layer w0.305: v1(48.88,42.18) 48.88,41.1 U23.33 ; R44.2 22.27,25.35 ; 22.27,25.35 21.34,26.29 17.94,26.29 C41.1 15.24,23.59 15.24,17.52 SW11.1 ; 22.27,25.35 23.58,25.35 v1(23.8,25.13) ; v1(23.75,18.42) 23.8,18.36 SW11.2
  Bottom Layer w0.305: v1(48.88,42.18) 48.88,42.43 48.04,43.27 46.35,43.27 44.48,41.4 34.04,41.4 33.02,40.39 33.02,31.44 26.72,25.13 v1(23.8,25.13) 23.75,25.08 v1(23.75,18.42)
KEY2: length 71.1
  Top Layer w0.305: SW12.1 SW12.2 19.19,13.59 19.19,19.94 ; U23.34 48.08,42.11 v1(48.13,42.16) ; C42.1 19.19,19.94 ; 19.19,19.94 20.57,19.94 22.25,21.61 R45.2 v1(24.51,22.35)
  Bottom Layer w0.305: v1(48.13,42.16) 47.43,42.87 46.52,42.87 44.54,40.89 34.29,40.89 33.53,40.13 33.53,31.37 v1(24.51,22.35)
KEY3: length 118.1
  Top Layer w0.305: v1(48.13,17.53) 48.3,17.36 SW13.1 SW13.2 69.85,15.56 69.85,9.78 73.67,5.96 C43.1 ; v1(41.53,38.1) 42.16,38.74 43.05,38.74 43.36,38.43 44.4,38.43 v1(44.7,38.74) ; 47.59,40.17 47.59,39.34 v1(46.35,38.1)
  Bottom Layer w0.305: v1(46.35,38.1) 45.72,38.74 v1(44.7,38.74) ; v1(41.53,38.1) 41.53,35.31 28.7,22.48 26.9,22.48 24.64,20.22 24.64,18.42 17.53,11.3 17.53,9.91 19.81,7.62 38.23,7.62 v1(48.13,17.53)
KEY4: length 80
  Top Layer w0.305: 47.04,40.19 47.04,39.67 45.34,37.97 v1(42.29,37.97) ; R47.2 77.59,7.1 76.2,5.72 76.2,4.45 C44.1 76.21,3.94 75.69,3.43 71.75,3.43 71.12,4.06 71.12,5.78 SW14.2 SW14.1 47.15,8.85 v1(34.54,21.46)
  Bottom Layer w0.305: v1(42.29,37.97) 42.29,34.99 34.54,27.24 v1(34.54,21.46)
KEY5: length 108.8
  Top Layer w0.305: C50.1 80,5.32 81.48,6.81 R53.2 83.69,9.58 83.69,13.06 SW15.2 72.7,14.95 ; v1(47.11,42.21) 46.85,42.21 46.58,41.94 46.58,41.68 ; 87.12,39.51 88.36,38.27 88.36,20.33 83.13,15.1 82.47,15.1
  Inner2 w0.305: v1(55.25,43.05) 51.56,46.74 v1(51.56,49.78)
  Bottom Layer w0.305: v1(55.25,43.05) 55.25,40.31 59.18,36.37 62.29,36.37 63.27,35.4 72.18,35.4 76.04,39.26 81.23,39.26 81.44,39.06 86.71,39.06 v1(87.12,39.47) ; v1(47.11,42.21) 47.78,41.54 49.05,41.54 49.66,42.15 49.66,43.96 50.71,45.01 50.71,48.93 v1(51.56,49.78)
LCD_CS1: length 33.7
  Top Layer w0.305: v1(46.86,34.42) 48.2,35.76 50.54,35.76 U23.26 ; v1(37.21,25.27) 36.94,25.27 29.97,18.31 29.97,16 30.2,15.78 FPC4.8
  Bottom Layer w0.305: v1(46.86,34.42) 42.87,34.42 37.52,29.07 37.52,25.58 v1(37.21,25.27)
LCD_CS2: length 29
  Top Layer w0.305: v1(44.07,36.2) 43.96,36.3 U23.54 ; v1(36.7,25.78) 32.25,21.32 U36.8
  Bottom Layer w0.305: v1(44.07,36.2) 36.7,28.83 v1(36.7,25.78)
LCD_DC: length 42.9
  Top Layer w0.305: FPC4.4 29.52,13.78 29.21,13.46 29.21,12.44 U36.4 ; v1(52.07,33.15) 51.72,32.8 U23.20
  Bottom Layer w0.305: U36.4 30.61,13.84 36.45,13.84 v1(48.13,25.53) 53.21,30.61 53.21,32.39 52.45,33.15 v1(52.07,33.15)
LCD_RST: length 47
  Top Layer w0.305: v1(53.85,31.88) 53.77,31.8 U23.18 ; FPC4.3 29.91,13.28 29.62,12.98 29.62,12.09 29.21,11.68 29.21,9.94 U36.3
  Bottom Layer w0.305: v1(53.85,31.88) 53.85,30.35 v1(48.89,25.4) 36.83,13.34 31.12,13.34 29.34,11.56 29.34,10.07 U36.3
LCD_SCL: length 37.6
  Top Layer w0.305: v1(52.2,32.39) 52.11,32.3 U23.19 ; U36.6 28.7,15.71 28.7,15.11 29.08,14.73 31.31,14.73 FPC4.6
  Bottom Layer w0.305: U36.6 32.83,16.32 41.28,24.77 44.93,24.77 46.35,26.19 46.35,27.43 47.39,28.47 48.63,28.47 52.2,32.03 v1(52.2,32.39)
LCD_SDA: length 37.3
  Top Layer w0.305: FPC4.5 29.26,14.28 28.81,13.82 U36.5 ; U23.21 50.54,33.26 49.51,33.26 49.07,32.82 49.07,27.26 47.22,25.4 v1(47.12,25.4)
  Bottom Layer w0.305: U36.5 28.62,14.35 36.07,14.35 v1(47.12,25.4)
LED: length 27.1
  Top Layer w0.305: 49.72,44.2 50.89,44.2
  Bottom Layer w0.305: 42.47,40.28 48.41,40.28 50.8,42.67 50.8,44.07 ; 42.47,40.28 42.28,40.08 42.29,40.06 42.29,38.83 44.25,36.88 48.34,36.88 48.64,36.58 48.64,32.39 49.66,31.37 50.29,31.37 v1(50.42,31.24)
  vias: v1(50.89,44.2)
OUT1: length 41.6
  Top Layer w0.305: U25.5 82.42,49.02 80.42,51.03 77.19,51.03 73.26,47.09 R56.1 74.86,44.89 v1(75.82,45.85)
  Bottom Layer w0.305: v1(75.82,45.85) 76.2,46.23 85.34,46.23 87.12,44.45 87.12,42.42 92.96,36.58 H3.1
OUT1_CS: length 36.5
  Top Layer w0.305: v1(70.74,46.1) 73.03,48.39 73.03,50.79 R56.2 73.67,51.44 80.95,51.44 U25.4 ; U24.5 63.3,38.3 65.28,36.32 v1(70.36,36.32)
  Bottom Layer w0.305: v1(70.36,36.32) 70.36,45.72 v1(70.74,46.1)
OUT1_CS2: length 39.1
  Top Layer w0.305: v1(76.07,23.62) 76.07,23.11 71.63,18.67 65.28,18.67 63.23,20.71 U28.5 ; v1(77.47,35.31) 78.41,36.25 R64.2 82.91,32.65 83.21,32.65
  Bottom Layer w0.305: v1(76.07,23.62) 76.07,33.02 77.47,34.42 v1(77.47,35.31)
OUT2: length 24.2
  Top Layer w0.305: R57.1 80.3,43.28 v1(82.04,41.53) ; U26.5 79.54,44.03 78.9,43.39
  Bottom Layer w0.305: v1(82.04,41.53) 86.74,41.53 94.23,34.04 H3.2
OUT2_1: length 24
  Top Layer w0.305: v1(81.03,30.48) 80.49,31.02 R64.1 79.4,32 83.21,32
  Bottom Layer w0.305: v1(81.03,30.48) 83.06,28.45 92.33,28.45 95,25.78
OUT2_2: length 28.3
  Top Layer w0.305: 81.23,27.99 81.23,26.97 v1(81.28,26.92) ; 81.23,27.99 80.39,28.83 75.33,28.83 R65.1 ; 81.23,27.99 82.42,26.8 83.21,26.8
  Bottom Layer w0.305: H4.2 93.22,25.02 82.93,25.02 81.28,26.67 v1(81.28,26.92)
OUT2_3: length 22.8
  Top Layer w0.305: v1(80.52,19.81) 79.61,19.81 78.47,20.96 ; 83.21,20.96 78.47,20.96 ; 78.47,20.96 R66.1
  Bottom Layer w0.305: v1(80.52,19.81) 81.03,19.3 93.6,19.3 H4.3
OUT2_CS: length 29.9
  Top Layer w0.305: 78.9,49.52 R57.2 78.9,47.47 ; 78.9,47.47 78.9,47.15 v1(77.34,45.59) ; 78.9,47.47 81.69,44.68 82.87,44.68 ; U24.8 65.25,38.51 66.67,37.08 70.36,37.08 72.64,39.37 74.29,39.37 74.42,39.5
  Bottom Layer w0.305: v1(74.55,39.5) 75.95,40.89 75.95,44.2 v1(77.34,45.59)
OUT2_CS2: length 36.2
  Top Layer w0.305: U28.8 65.18,20.54 66.42,19.3 v1(71.37,19.3) ; v1(70.74,23.75) 70.74,30.37 R65.2 73.17,32.24 76.07,29.34 81.32,29.34 83.21,27.45
  Bottom Layer w0.305: v1(71.37,19.3) 70.74,19.94 v1(70.74,23.75)
OUT3: length 36.9
  Top Layer w0.305: U27.5 76.36,39.24 R58.1 74.24,36.14 v1(75.56,37.47)
  Bottom Layer w0.305: H3.3 93.98,31.5 87.89,37.59 81.91,37.59 80.77,38.74 76.71,38.74 75.56,37.59 v1(75.56,37.47)
OUT3_CS: length 22.5
  Top Layer w0.305: U24.9 65.9,38.62 66.93,37.59 68.45,37.59 73.13,42.27 73.26,42.27 75.4,40.13 82.73,40.13 U27.4
OUT3_CS2: length 25.5
  Top Layer w0.305: 83.21,21.61 83.21,22.35 R66.2 70.77,19.81 66.8,19.81 65.83,20.78 U28.9
RST: length 51.1
  Top Layer w0.305: 12.38,10.66 12.38,11.45 R33.1 9.93,13.9 C32.2 ; 12.38,10.66 18.15,10.66 v1(18.41,10.92) ; 12.38,10.66 12.38,9.91 ; v1(45.72,26.54) 45.72,26.8 45.13,27.39 44.75,27.39 44.08,28.06 U23.7
  Bottom Layer w0.305: v1(18.41,10.92) 20.19,10.92 26.92,17.65 28.32,17.65 28.51,17.46 33.33,17.46 41.15,25.27 44.45,25.27 v1(45.72,26.54)
SERVO1: length 108.7
  Top Layer w0.305: v1(34.92,40.13) 31.24,40.13 v1(30.23,41.15) ; v1(88.26,60.71) 47.88,60.71 45.09,57.91 30.86,57.91 30.23,58.55 v1(23.49,58.55) ; v1(40.64,39.12) 40.64,38.21 40.23,37.8 U23.51
  Bottom Layer w0.305: v1(34.92,40.13) 35.23,40.44 40.21,40.44 40.64,40.01 v1(40.64,39.12) ; U33.1 91.42,57.55 v1(88.26,60.71) ; v1(30.23,41.15) 30.23,48.26 28.45,50.04 25.4,50.04 24.26,51.18 24.26,54.74 22.48,56.52 22.48,57.53 v1(23.49,58.55)
SERVO2: length 52.5
  Top Layer w0.305: v1(56.51,50.8) 59.94,50.8 v1(60.07,50.67) ; U23.56 46.35,35.3 v1(49.15,38.1)
  Bottom Layer w0.305: v1(60.07,50.67) 60.58,51.18 73.18,51.18 U32.1 ; v1(56.51,50.8) 56.51,50.67 54.36,48.51 54.36,44.45 51.18,41.28 51.18,40.13 v1(49.15,38.1)
SWCLK: length 33.1
  Top Layer w0.305: v1(37.21,43.43) 37.21,38.74 37.64,38.3 U23.50
  Bottom Layer w0.305: 23.49,60.38 25.4,58.47 25.4,51.56 25.91,51.05 32.26,51.05 37.21,46.1 v1(37.21,43.43)
SWDIO: length 30.1
  Top Layer w0.305: v1(37.85,43.94) 37.85,38.99 38.03,38.8 U23.49
  Bottom Layer w0.305: v1(37.85,43.94) 37.85,46.23 32.51,51.56 28.25,51.56 27.94,51.87 27.94,58.47 JP7.2
UART1_RX: length 14.3
  Top Layer w0.305: U23.60 37.69,33.3 37.03,33.96 37.03,38.02 36.45,38.61 36.45,45.18 U19.6
UART1_TX: length 13.6
  Top Layer w0.305: U19.7 38.48,45.18 v1(38.48,39.37) ; U23.59 37.95,33.8 37.59,34.16 v1(37.59,34.67)
  Bottom Layer w0.305: v1(37.59,34.67) 37.59,38.48 v1(38.48,39.37)
UART3_RX: length 41
  Top Layer w0.305: U34.3 64.2,52.93 60.68,52.93 59.16,51.41 55.73,51.41 v1(55.12,50.8) ; U23.53 46.9,36.8 50.36,40.26 v1(50.42,40.26)
  Bottom Layer w0.305: v1(55.12,50.8) 52.73,48.41 52.73,43.45 50.42,41.14 v1(50.42,40.26)
UART3_TX: length 45.2
  Top Layer w0.305: U23.52 46.83,37.3 49.4,39.88 v1(49.4,40.26) ; v1(54.48,51.05) 55.25,51.82 58.8,51.82 60.32,53.34 64.01,53.34 67.06,56.39 67.06,57.79 67.44,58.17 69.68,58.17 U34.4
  Bottom Layer w0.305: v1(54.48,51.05) 52.32,48.9 52.32,43.62 49.4,40.7 v1(49.4,40.26)
VM: length 145
  Top Layer w0.305: v2(62.6,20.45) 62.67,20.38 C64.2 ; C56.2 62.67,38.3 v2(62.61,38.35)
  Top Layer w0.381: v2(67.21,20.45) 67.13,20.52 U28.11 ; U28.4 62.6,22.64 v2(62.6,20.45) ; U24.4 62.65,38.4 v2(62.61,38.35) ; v2(67.31,38.35) 67.2,38.46 U24.11
  Top Layer w0.762: C51.2 54.23,47.11 v2(54.23,42.83) v2(54.23,40.01) ; v2(54.36,22.67) 54.36,24.1 C66.2 C60.2 54.33,29.91 54.2,29.78 C59.2
  Top Layer w1.016: R26.2 19.01,35.22 18.1,36.13 C27.2 ; 11.05,35.94 11.24,36.13 C26.2 C27.2 ; C27.2 16.03,38.9
  Top Layer w2.032: 10.92,35.69 10.92,30.99 D4.2 6.98,26.54 S4.2 ; 18.44,35.78 18.32,35.66 18.32,33.15 ; v2(18.41,32.64) 18.41,32 18.44,31.97
  Inner1 w0.762: 54.36,21.72 v2(54.36,22.67) v2(54.36,25.74) v2(54.36,28.67) 54.36,30.1 ; 54.36,21.72 55.63,20.45 v2(62.6,20.45) 67.44,20.45 ; 54.36,21.72 54.23,21.59 39.88,21.59 37.72,23.75 21.97,23.75 18.41,27.31 v2(18.41,32.64) ; 54.23,38.07 54.23,37.85 55.12,36.96 55.12,33.15 ; 54.23,38.07 54.52,38.35 v2(62.61,38.35) v2(67.31,38.35) ; 54.23,38.07 v2(54.23,40.01) ; 55.12,32.89 55.12,31.24 54.1,30.23
  Inner1 w2.032: v2(18.41,32.64) 18.41,33.25 18.44,33.27
  vias: v2(17.78,33.53) v2(17.78,31.75) v2(19.05,33.66) v2(19.18,31.75)
$1N15960: length 8.9
  Top Layer w0.381: R27.2 22.55,37.22 R26.1 18.41,37.22 17.27,38.35 17.27,39.62 17.78,40.13 U12.5
$1N15961: length 7.4
  Top Layer w0.762: U12.2 L2.1 ; 15.91,42.67 15.62,42.67 14.1,41.15 13.59,41.15 12.83,40.39
$1N15964: length 9.2
  Top Layer w0.381: R29.2 15.66,48.77 19.67,48.77 20.7,47.75
  Top Layer w0.762: 14.37,45.57 R28.1 R29.2
$1N15965: length 15.3
  Top Layer w0.381: 20.7,46.35 20.18,46.86 16.49,46.86 16.25,47.1 ; U12.4 18.37,39.12 18.8,39.12 19.3,39.62 19.3,43.06 R30.2
  Top Layer w0.762: 16.38,45.57 16.25,45.69 16.25,47.1 R29.1
$1N16007: length 17.5
  Top Layer w2.032: S4.3 4.06,31.86 4.06,43.54 CN1.2
$1N16014: length 1.9
  Top Layer w0.762: C28.1 18.31,41.95 U12.6
$1N16018: length 2.9
  Top Layer w0.305: 47.81,46.86 47.51,47.17 R34.2
$1N16021: length 2.5
  Top Layer w0.305: 47.62,43.93 47.37,43.68 45.2,43.68
$1N16033: length 2.6
  Top Layer w0.635: 39.37,43.57 C47.1 ; 39.37,43.57 39.37,43.14 ; 39.37,43.57 U19.8
$1N16042: length 2.3
  Top Layer w0.305: USB1.4 39.48,53.86 R51.1
$1N16043: length 2.1
  Top Layer w0.305: USB1.10 36.48,52.76 R52.1
$1N16080: length 3.7
  Top Layer w0.305: U23.5 43.08,27.97 41.91,26.79 42.18,26.52 X4.1
$1N16081: length 3.5
  Top Layer w0.305: X4.3 44.58,26.95 43.58,27.95 U23.6
$1N16176: length 3.9
  Top Layer w0.305: C56.1 61.27,38.4 61.26,38.4 61.98,39.12 61.98,40.67 U24.3
$1N16178: length 14
  Top Layer w0.305: U24.17 67.85,47.9 67.19,48.57 60.76,48.57 58.55,46.36 58.55,45.25 R60.1
$1N16180: length 13.2
  Top Layer w0.305: R61.1 58.78,47.17 60.59,48.97 67.36,48.97 68.5,47.83 U24.16
$1N16187: length 5.1
  Top Layer w0.305: U24.2 61.35,41.52 60.71,42.16 58.18,42.16 C57.2
$1N16188: length 6.4
  Top Layer w0.305: C57.1 56.19,40.31 56.5,40.01 60.4,40.01 60.71,40.31 60.71,40.69 U24.1
$1N16236: length 3.5
  Top Layer w0.305: U28.3 61.93,20.09 C64.1
$1N16238: length 13.2
  Top Layer w0.305: U28.17 67.78,29.25 66.37,30.66 60.63,30.66 57.87,27.9 R68.1
$1N16240: length 12.9
  Top Layer w0.305: U28.16 68.45,28.41 68.45,29.59 66.98,31.06 60.4,31.06 59.31,29.97 R69.1
$1N16247: length 4.5
  Top Layer w0.305: C65.2 60.32,24.38 61.28,23.43 U28.2
$1N16248: length 6
  Top Layer w0.305: U28.1 60.33,22.35 56.9,22.35 56.59,22.65 C65.1
$1N16306: length 3.5
  Top Layer w0.305: R31.1 26.67,53.71 H2.2
$1N16948: length 2.2
  Top Layer w0.305: R67.1 65.68,32.15 63.88,32.15 LED5.1
$1N16951: length 16.4
  Top Layer w0.305: LED5.2 60.78,31.5 59.94,31.5 v1(59.06,30.61) ; U28.18 67.13,29.26 66.29,30.1 v1(64.9,30.1)
  Bottom Layer w0.305: v1(59.06,30.61) 59.06,30.23 61.72,27.56 64.64,27.56 64.9,27.81 v1(64.9,30.1)
$1N17080: length 2.7
  Top Layer w0.305: 63.3,51.23 65.96,51.23 R59.1
$1N17085: length 12.1
  Top Layer w0.305: LED6.2 62.23,52.36 66.51,52.36 66.8,52.07 v1(66.8,49.66) ; U24.18 67.2,47.6 v1(66.8,48.01)
  Bottom Layer w0.305: v1(66.8,48.01) v1(66.8,49.66)

## Copper pours and planes (outline as drawn; the poured copper is in the pictures)
GND on Top Layer: -6.18,68.37 102.68,68.37 102.68,-1.61 -6.18,-1.61
GND on Inner1: -3.94,67.44 103.38,67.44 103.38,-2.16 -3.94,-2.16
GND on Inner2: -5.07,71.69 105.04,71.69 105.04,-3.88 -5.07,-3.88

Small or netless copper shapes (teardrops, artwork), in the pictures only: 444 on Top Layer, 163 on Bottom Layer, 41 on Inner1, 2 on Inner2

## Text on the board
Top Silkscreen Layer: [GND 3V3] | [CLK->3V3] | [GND 3V3 SCL SDA] | [GND 3V3 3_TX 3_RX] | [PWM2 5V GND] | [PWM1 5V GND] | [CANH CANL] | TwisterDriver V1.5 / Created By Nino / --2023.3.30 | RST | [↑ON↓OFF] | ↑KEY1 | ↓KEY2 | ↑KEY3 | ↓KEY4 | →KEY5 | ENCODER2 | ENCODER1 | BLDC1 | BLDC2
